# EasyEDA schematic SCH_CANSAT-ADÓK_2025-02-23.json
TITLE: CAN modul; REV: 1.0; Date: 2025-02-07; Sheet: 1/1; Drawn By: Burger Alfréd; Company: TFS SAT
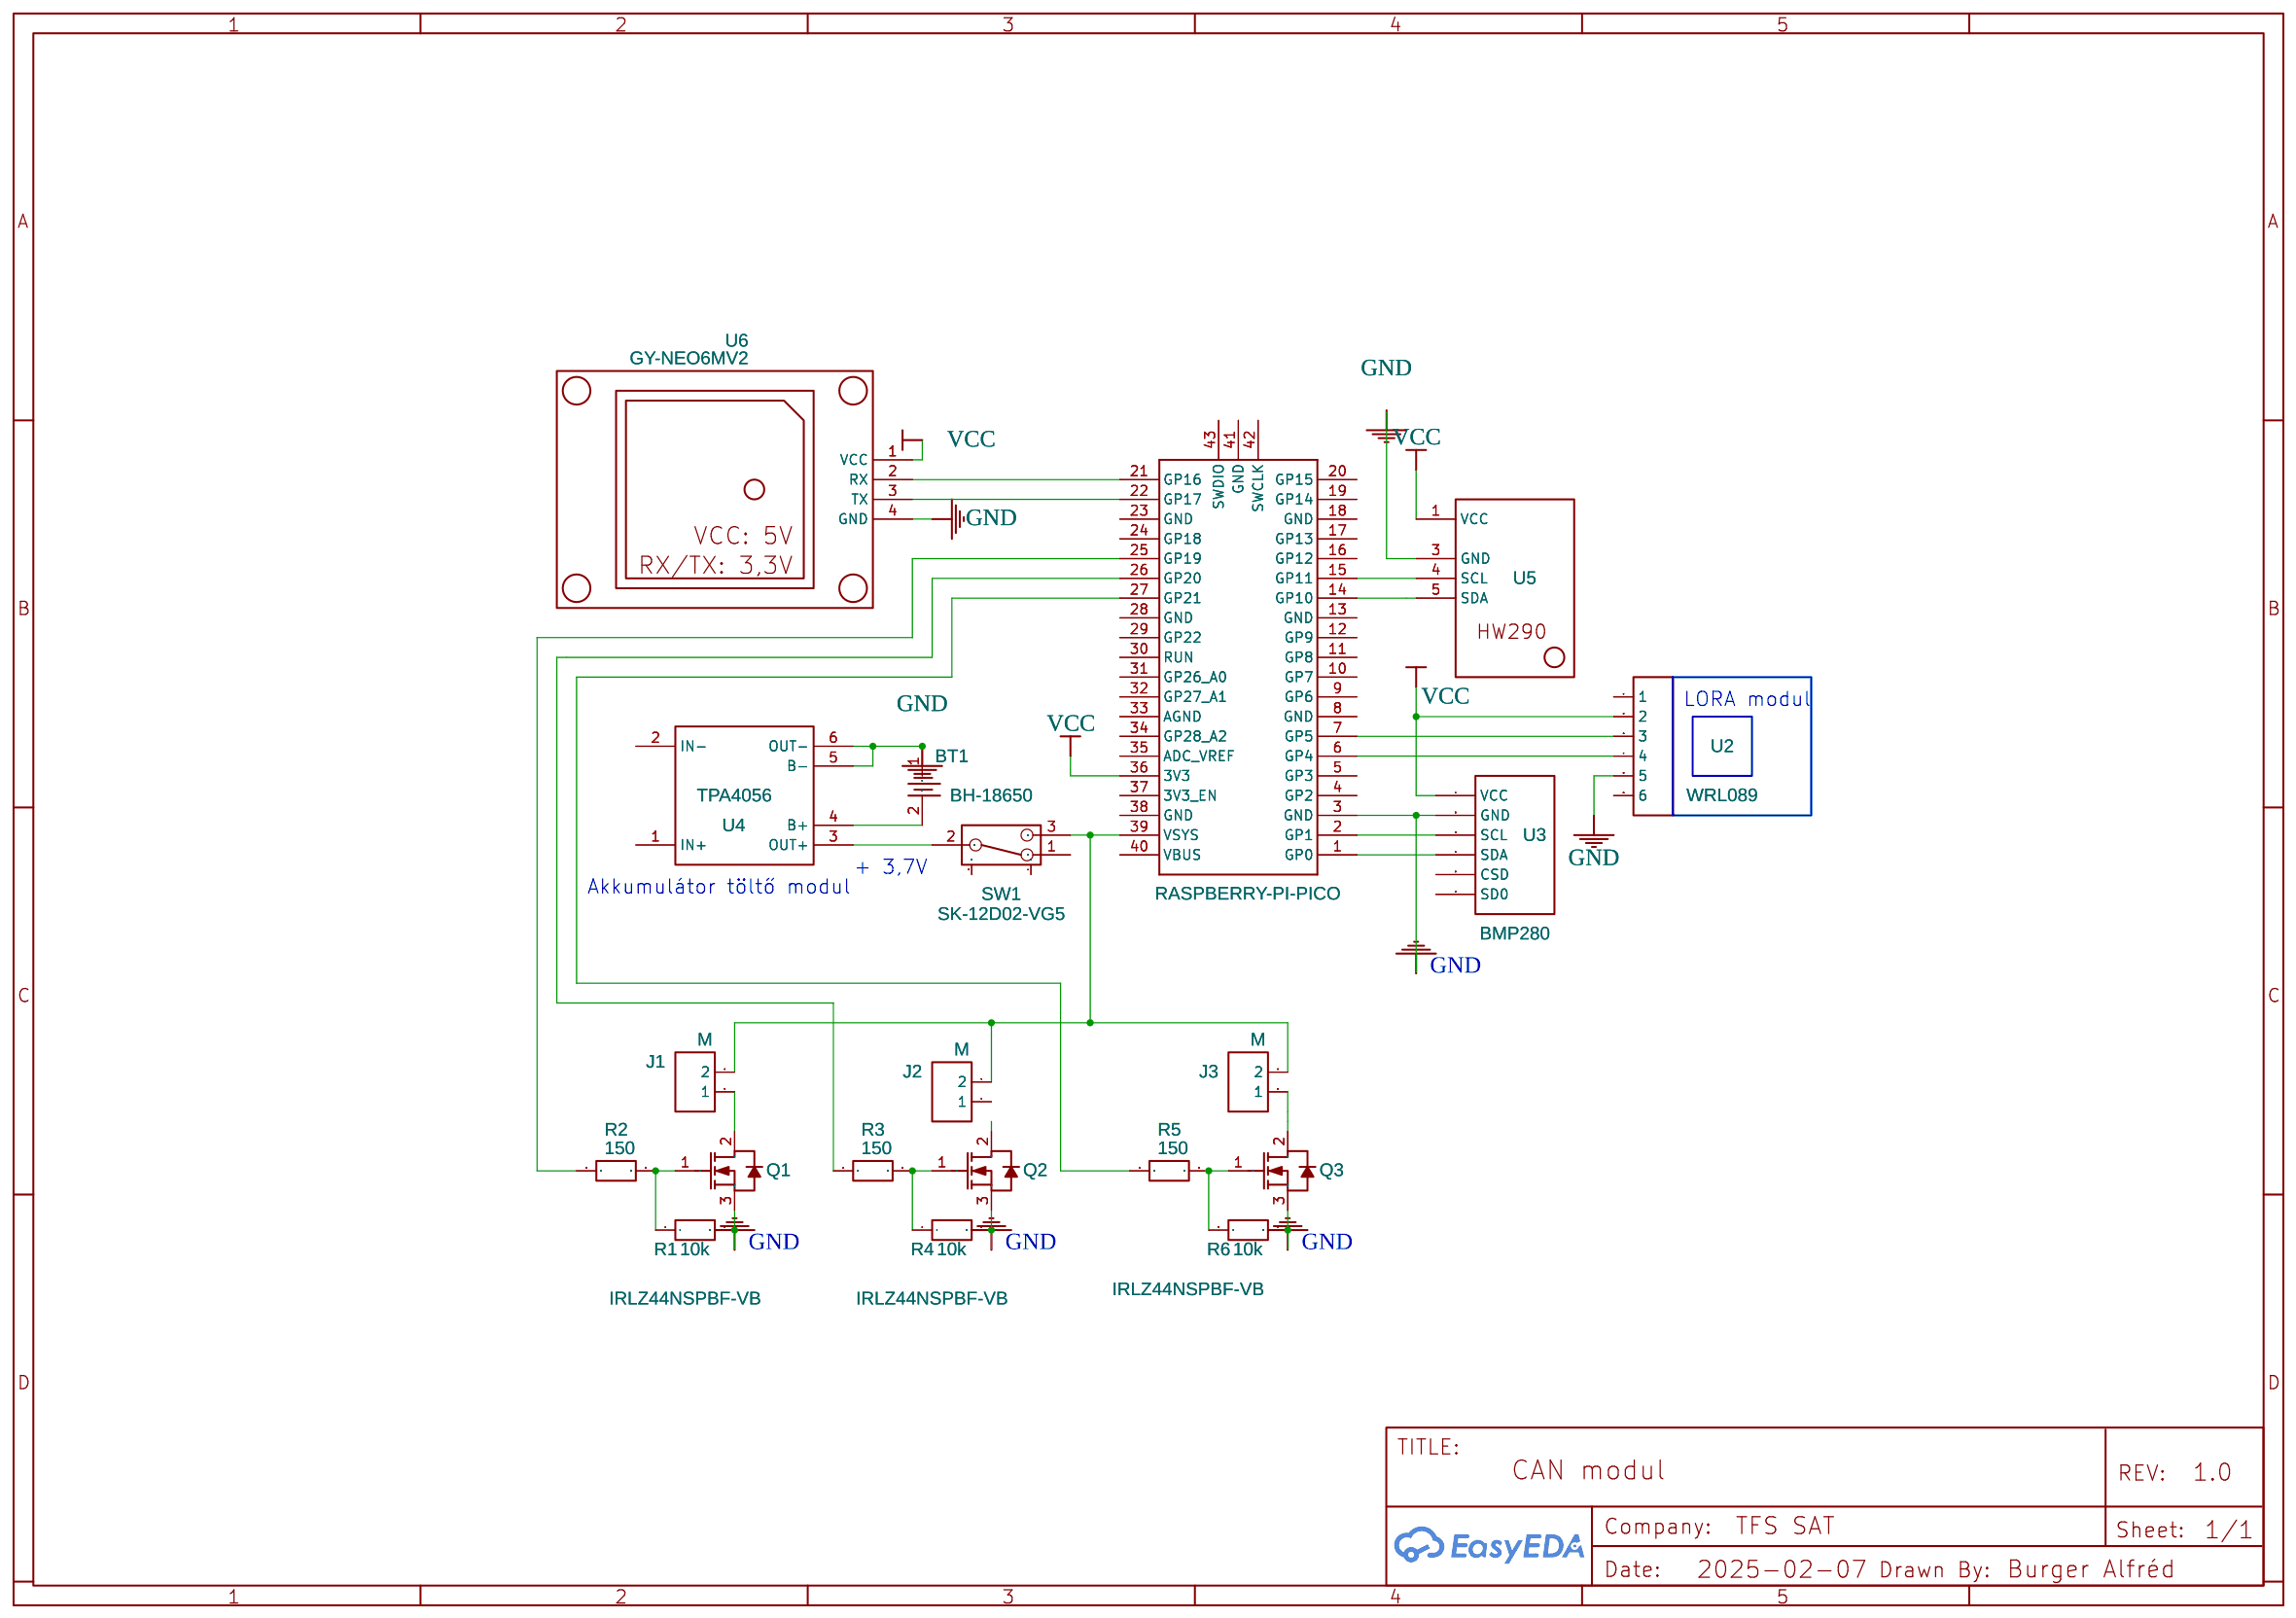
[diagram p0: schematic sheet]

## Parts
2  RASPBERRY-PI-PICO  [RASPBERRY-PI-PICO]
BT1  BH-18650  [BATTERY-SMD_18650-1S-L77.1-W20.7-1]
J1  M  [HDR-M-2.54_1X2]
J2  M  [HDR-M-2.54_1X2]
J3  M  [HDR-M-2.54_1X2]
Q1  IRLZ44NSPBF-VB  [TO-263-3_L10.2-W9.2-P5.08-LS15.4-BR]
Q2  IRLZ44NSPBF-VB  [TO-263-3_L10.2-W9.2-P5.08-LS15.4-BR]
Q3  IRLZ44NSPBF-VB  [TO-263-3_L10.2-W9.2-P5.08-LS15.4-BR]
R1  10k  [R0603]
R2  150  [R0603]
R3  150  [R0603]
R4  10k  [R0603]
R5  150  [R0603]
R6  10k  [R0603]
SW1  SK-12D02-VG5  [SW-TH_SK-12D02VG3]
U2  WRL089  [HDR-M-2.54_1X6]
U3  BMP280  [BMP280YSF BMP280YSF BMP280YSF BMP]
U4  TPA4056  [TPA4056]
U5  HW290  [10DOF-HW290]
U6  GY-NEO6MV2  [GY-GPS6MV2GPSMODUL]

## Library data of the parts
2 = RASPBERRY-PI-PICO_TH/SMT: Contributor: RobWils; Supplier: Raspberry Pi; Supplier Part: RP2040; Manufacturer: Raspberry Pi Foundation; Package Display: No
BT1 = BH-18650-B1BA002: Contributor: lcsc; Supplier: LCSC; Supplier Part: C2988620; Manufacturer: MYOUNG(美阳); JLCPCB Part Class: Extended Part
J1-J3 = HDR-M-2.54_1x2: Supplier Part: C124375; Supplier: LCSC; Contributor: LCEDA_Lib
Q1-Q3 = IRLZ44NSPBF-VB: Supplier: LCSC; Supplier Part: C19188232; Manufacturer: VBsemi(微碧半导体); Contributor: lcsc; JLCPCB Part Class: Extended Part
R1-R6 = R_0603_EU: Contributor: LCEDA_Lib
SW1 = SK-12D02-VG5: Supplier: LCSC; Supplier Part: C136722; Manufacturer: Rectangular Connectors - Contacts; Contributor: LCSC
U2 = HDR-M-2.54_1x6: Supplier Part: C190819; Supplier: LCSC; Contributor: LCEDA_Lib
U3 = BMP280: Contributor: Calibre320
U4 = TPA4056: Manufacturer Part: Djinn_sensor SchematicLib; Contributor: marky8320
U5 = 10DOF-HW290-SYMBOL: Contributor: Rahul Narayanan
U6 = GY-GPS6MV2GPSModul: Contributor: Mavera Teknoloji Takımı

## Nets
GND: 2.3(GND) BT1.1 Q1.3(S) Q2.3(S) Q3.3(S) R1.2 R4.2 R6.2 U2.5 U3.6(GND) U4.5(B-) U4.6(OUT-) U5.3(GND) U6.4(GND)
VCC: 2.36(3V3) U2.2 U3.7(VCC) U5.1(VCC) U6.1(VCC)
Net-(2-1): 2.1(GP0) U3.4(SDA)
Net-(2-2): 2.2(GP1) U3.5(SCL)
Net-(2-6): 2.6(GP4) U2.4
Net-(2-7): 2.7(GP5) U2.3
Net-(2-14): 2.14(GP10) U5.5(SDA)
Net-(2-15): 2.15(GP11) U5.4(SCL)
Net-(2-21): 2.21(GP16) U6.2(RX)
Net-(2-22): 2.22(GP17) U6.3(TX)
Net-(2-25): 2.25(GP19) R2.1
Net-(2-26): 2.26(GP20) R3.1
Net-(2-27): 2.27(GP21) R5.1
Net-(2-39): 2.39(VSYS) J1.2 J2.2 J3.2 SW1.3
Net-(BT1-2): BT1.2 U4.4(B+)
Net-(J1-1): J1.1 Q1.2(D)
Net-(J3-1): J3.1 Q3.2(D)
Net-(Q1-1): Q1.1(G) R1.1 R2.2
Net-(Q2-1): Q2.1(G) R3.2 R4.1
Net-(Q3-1): Q3.1(G) R5.2 R6.1
Net-(SW1-2): SW1.2 U4.3(OUT+)

Not connected (* = marked no-connect by the designer): 2 4(GP2) 5(GP3) 8(GND) 9(GP6) 10(GP7) 11(GP8) 12(GP9) 13(GND) 16(GP12) 17(GP13) 18(GND) 19(GP14) 20(GP15) 23(GND) 24(GP18) 28(GND) 29(GP22) 30(RUN) 31(GP26_A0) 32(GP27_A1) 33(AGND) 34(GP28_A2) 35(ADC_VREF) 37(3V3_EN) 38(GND) 40(VBUS) 41(GND) 42(SWCLK) 43(SWDIO); J2 1; Q2 2(D); SW1 1 4 5; U2 1 6; U3 2(SD0) 3(CSD); U4 1(IN+) 2(IN-)

## Notes on the sheet
- LORA modul
- + 3,7V
- Akkumulátor töltő modul
